# Altium schematic sheet SerialPort.SchDoc
size A4; SheetNumber: 3; SheetTotal: 2
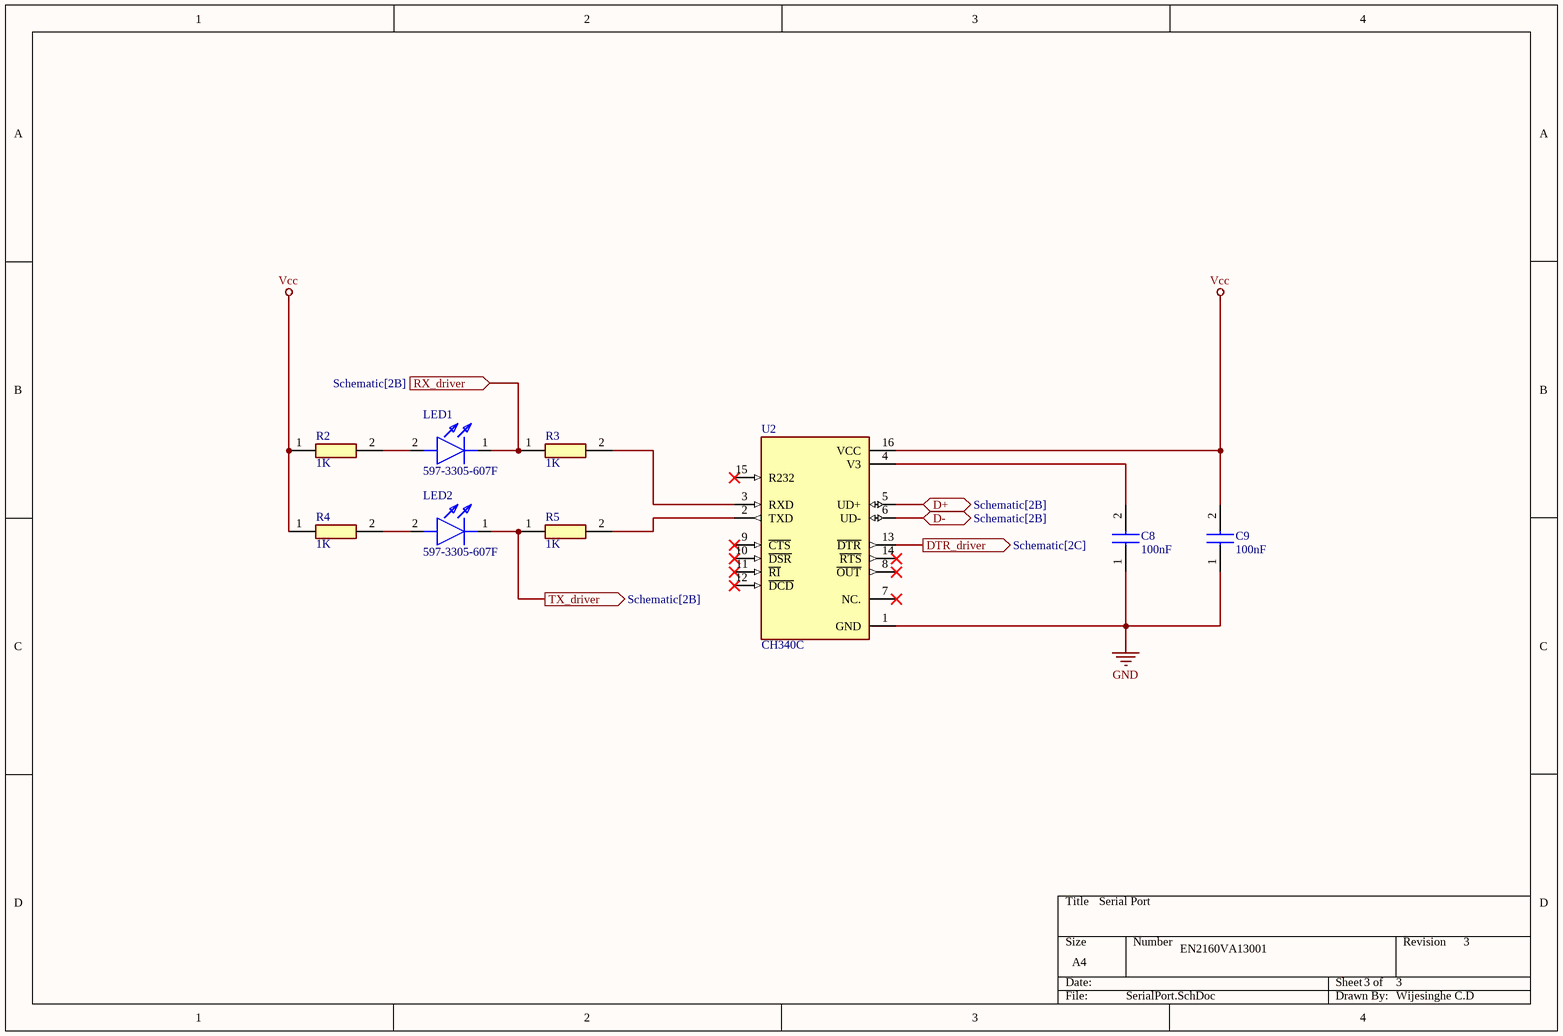
[diagram p0: SerialPort.SchDoc]

## Parts
C8  100nF  [CAPC2013X137N]
C9  100nF  [CAPC2013X137N]
LED1  597-3305-607F  [LEDC2012X70N]
LED2  597-3305-607F  [LEDC2012X70N]
R2  1K  [RESC2012X60N]
R3  1K  [RESC2012X60N]
R4  1K  [RESC2012X60N]
R5  1K  [RESC2012X60N]
U2  CH340C  [SOIC127P600X180-16N]

## Ports
D+ (bidir, see Schematic[2B]), D- (bidir, see Schematic[2B]), DTR_driver (out, see Schematic[2C]), RX_driver (in, see Schematic[2B]), TX_driver (out, see Schematic[2B])

## Nets
GND: C8.1 C9.1 U2.1(GND)
Vcc: C9.2 R2.1 R4.1 U2.16(VCC)
D+: U2.5(UD+) ; port D+
D-: U2.6(UD-) ; port D-
DTR_driver: U2.13(~{DTR}) ; port DTR_driver
RX_driver: LED1.1(K) R3.1 ; port RX_driver
TX_driver: LED2.1(K) R5.1 ; port TX_driver
NetC8_2: C8.2 U2.4(V3)
NetLED1_2: LED1.2(A) R2.2
NetLED2_2: LED2.2(A) R4.2
NetR3_2: R3.2 U2.3(RXD)
NetR5_2: R5.2 U2.2(TXD)

Not connected (* = marked no-connect by the designer): U2 7(NC.)* 8(~{OUT})* 9(~{CTS})* 10(~{DSR})* 11(~{RI})* 12(~{DCD})* 14(~{RTS})* 15(R232)*

## Notes on the sheet
- Serial Port
- EN2160VA13001
- 3
- Wijesinghe C.D

## Library data of the parts
C8 C9 = 0805B104K500NT: Capacitor; Manufacturer_Name: Novacap; Datasheet Link: https://componentsearchengine.com/Datasheets/1/0805B104K500NT.pdf; Height: 1.37mm; Manufacturer_Part_Number: 0805B104K500NT; Mouser Part Number: 767-0805B104K500NT; Mouser Price/Stock: https://www.mouser.com/Search/Refine.aspx?Keyword=767-0805B104K500NT
LED1 LED2 = 597-3305-607F: LED; Manufacturer_Name: Dialight; Datasheet Link: https://mouser.componentsearchengine.com/Datasheets/1/597-3305-607F.pdf; Height: 0.7mm; Manufacturer_Part_Number: 597-3305-607F; Mouser Part Number: 645-597-3305-607F; Mouser Price/Stock: https://www.mouser.com/Search/Refine.aspx?Keyword=645-597-3305-607F; Arrow Part Number: 597-3305-607F; Arrow Price/Stock: https://www.arrow.com/en/products/597-3305-607f/dialight
R2-R5 = RC0805FR-071KL: Resistor; Manufacturer_Name: YAGEO; Datasheet Link: https://www.yageo.com/upload/media/product/productsearch/datasheet/rchip/PYu-RC_Group_51_RoHS_L_11.pdf; Height: 0.6mm; Manufacturer_Part_Number: RC0805FR-071KL; Mouser Part Number: 603-RC0805FR-071KL; Mouser Price/Stock: https://www.mouser.co.uk/ProductDetail/YAGEO/RC0805FR-071KL?qs=1ogmaHw32WJjeGY0DHXakQ%3D%3D; Arrow Part Number: RC0805FR-071KL; Arrow Price/Stock: https://www.arrow.com/en/products/rc0805fr-071kl/yageo?region=europe
U2 = CH340C: USB to serial chip CH340; MF: WCH; Price: None; Availability: Not in stock; MP: CH340C; Package: None; SnapEDA_Link: https://www.snapeda.com/parts/CH340C/WCH/view-part/?ref=snap; Check_prices: https://www.snapeda.com/parts/CH340C/WCH/view-part/?ref=eda; Value: *